# Altium project ДФТВ.434519.003.PrjPcb
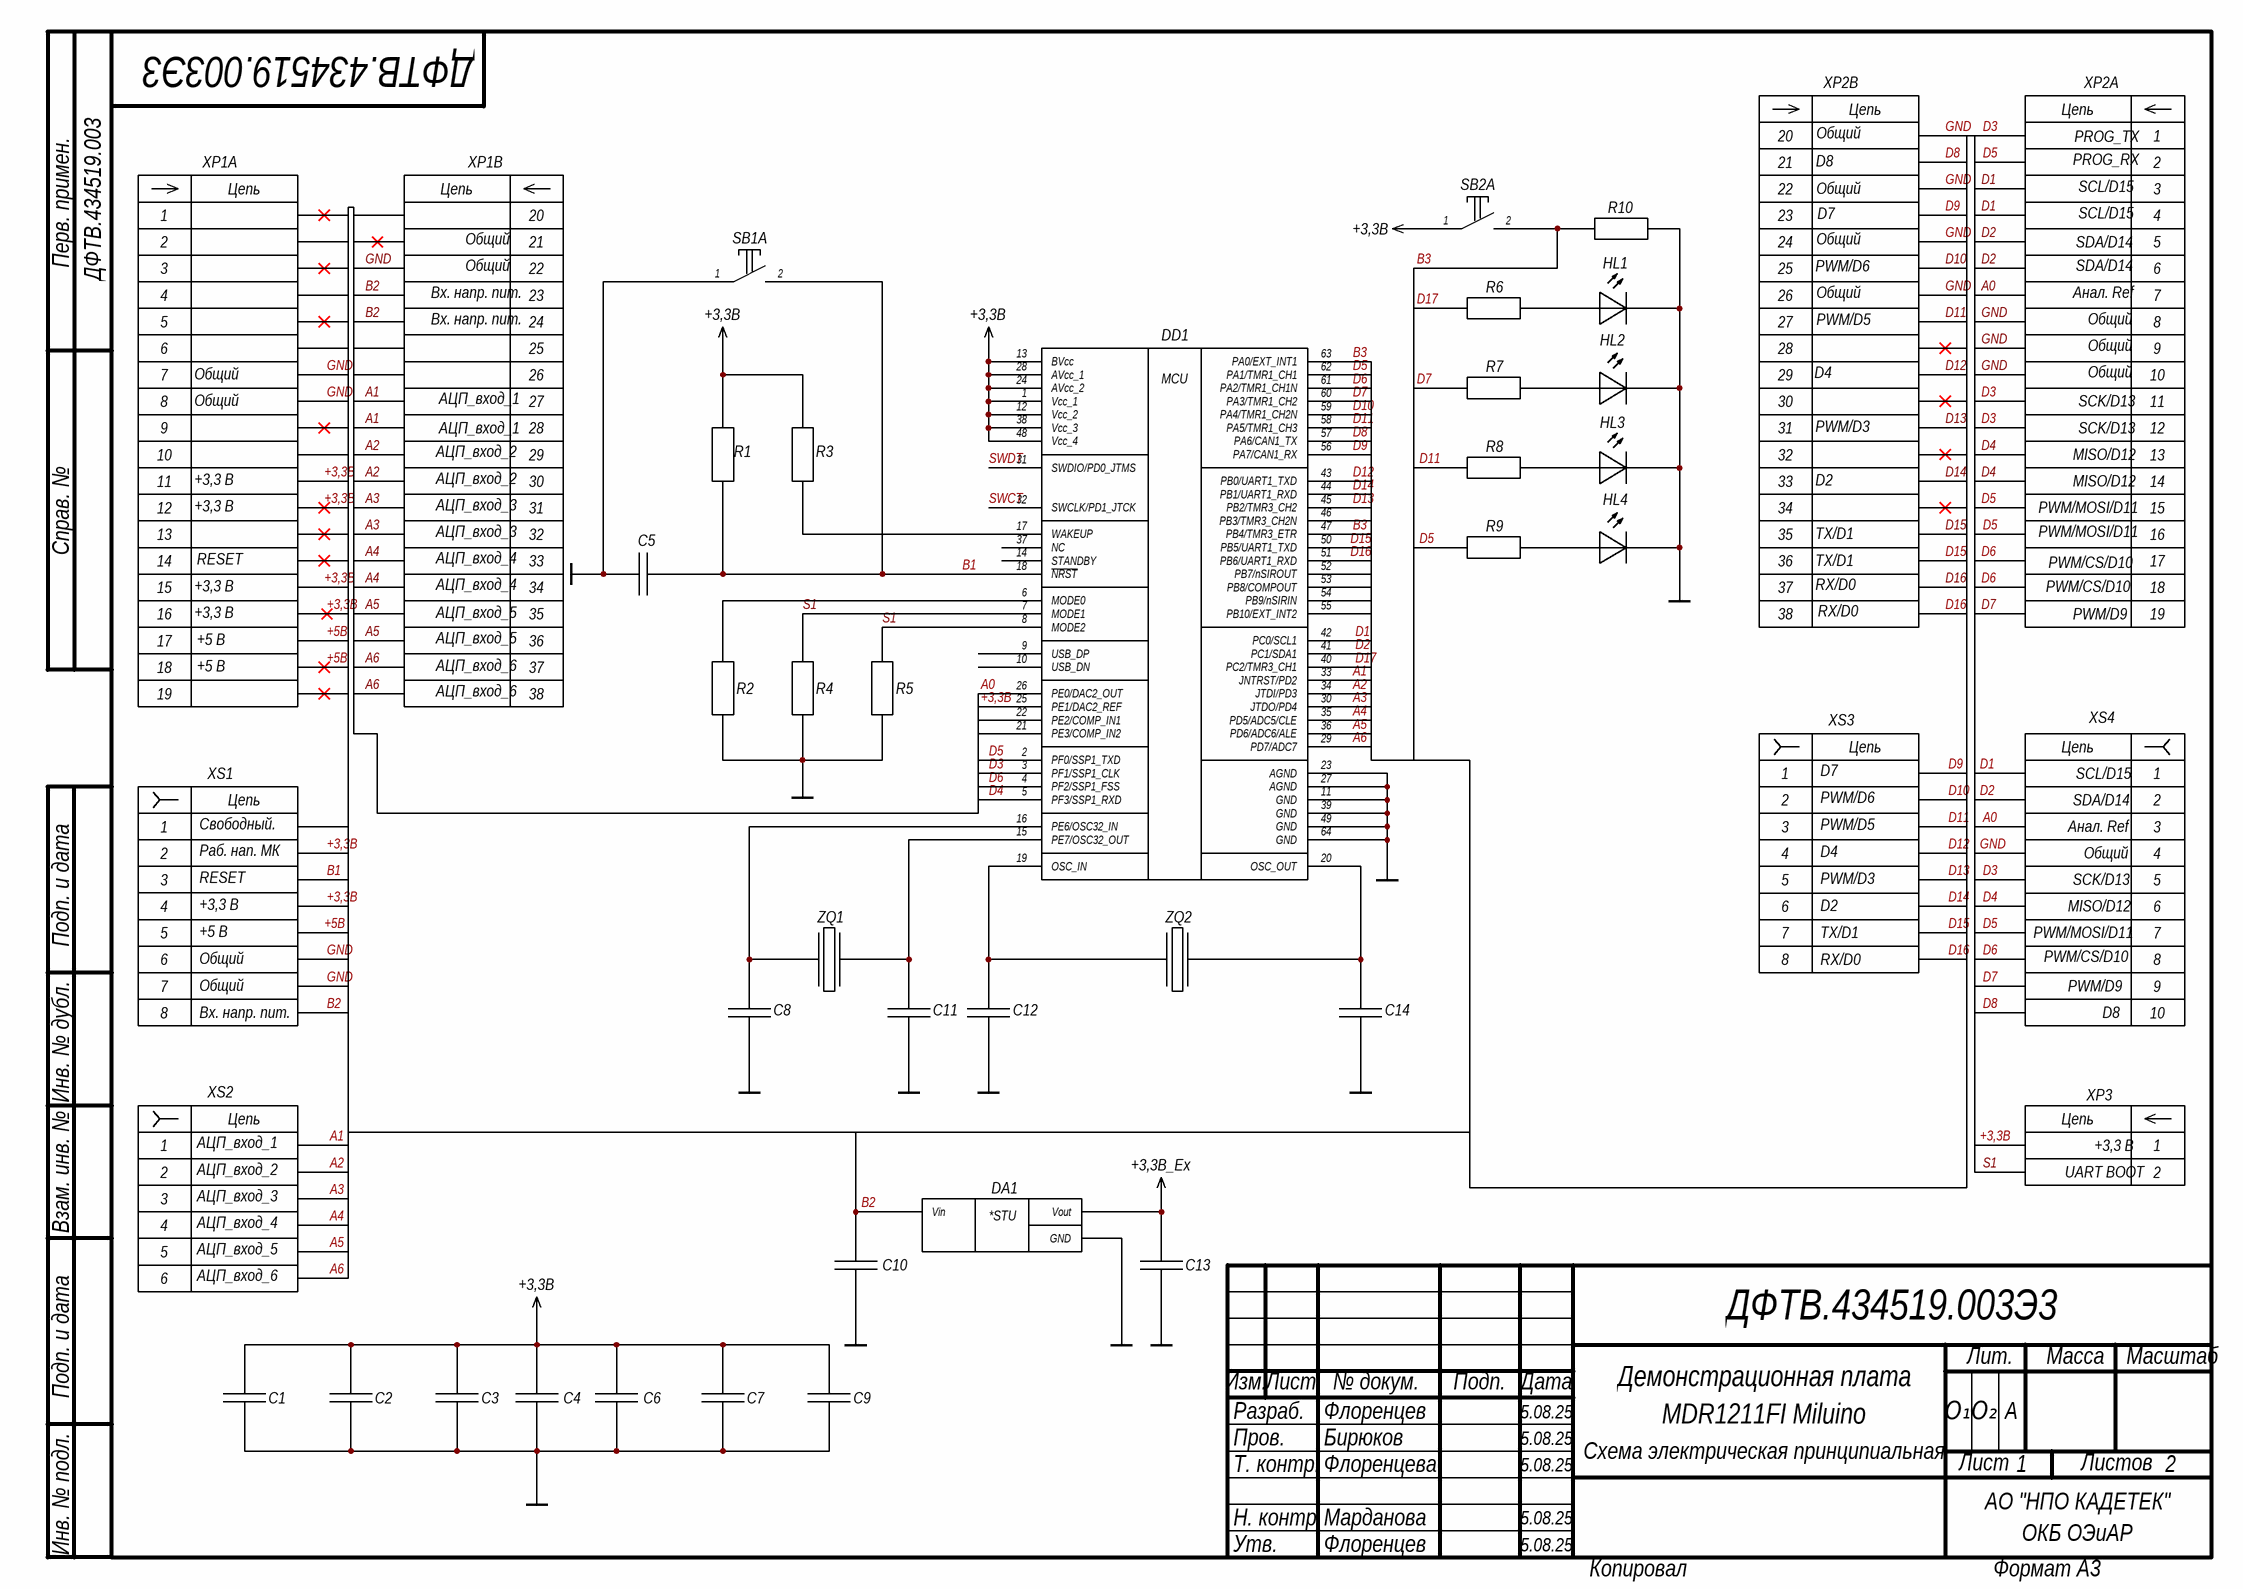
[diagram p0: ДФТВ.434519.003 л.1 Э3.SchDoc]
DecimalNumber: ДФТВ.434519.003; Графа 04 - Литера: О₁; Графа 04 - Литера2: О₂; Графа 04 - Литера3: А; Децимальный номер печатного узла: ДФТВ.434519.003; Код типа схемы: Э3; Компания1: АО "НПО КАДЕТЕК"; Компания2: ОКБ ОЭиАР; Литера1: О₁; Литера2: О₂; Литера3: А; Наименование1: Демонстрационная плата; Наименование2: MDR1211FI Miluino; Нормоконтроль: Марданова; Нормоконтроль_дата: 5.08.25; Обозначение: ДФТВ.434519.003Э3; Папка для сохранения графической документации: Документация; Папка для сохранения текстовой документации: Документация; Проверил: Бирюков; Проверил_дата: 5.08.25; Разработал: Флоренцев; Разработал_дата: 5.08.25; Технолог: Флоренцева; Технолог_дата: 5.08.25; Тип документа: Схема электрическая принципиальная; Утвердил: Флоренцев; Утвердил_дата: 5.08.25
2 sheets, 86 parts. Net scope: global (net labels, ports and power ports of the same name join across sheets).
Board files: ДФТВ.434519.003.101.PcbDoc, ДФТВ.434519.003.200КЭ.PcbDoc
Sheets:
  ДФТВ.434519.003 л.1 Э3.SchDoc
  ДФТВ.434519.003 л.2 Э3.SchDoc

## Sheet ДФТВ.434519.003 л.1 Э3.SchDoc
size 420 x 297 mm; SheetNumber: 1; SheetTotal: 2; ListNumber: 1

### Parts
C1  Конденсатор  [SMD_C0603]  (value not drawn)
C2  Конденсатор  [SMD_C0603]  (value not drawn)
C3  Конденсатор  [SMD_C0603]  (value not drawn)
C4  Конденсатор  [SMD_C0603]  (value not drawn)
C5  Конденсатор  [SMD_C0603]  (value not drawn)
C6  Конденсатор  [SMD_C0603]  (value not drawn)
C7  Конденсатор  [SMD_C0603]  (value not drawn)
C8  Конденсатор  [SMD_C0603]  (value not drawn)
C9  Конденсатор  [SMD_C0603]  (value not drawn)
C10  Конденсатор  [SMD_C0603]  (value not drawn)
C11  Конденсатор  [SMD_C0603]  (value not drawn)
C12  Конденсатор  [SMD_C0603]  (value not drawn)
C13  Конденсатор  [SMD_C0603]  (value not drawn)
C14  Конденсатор  [SMD_C0603]  (value not drawn)
DA1  Преобразователи напряжения  [SOT223]  (value not drawn)
DD1  Микроконтроллеры  [MDR-QFN64_N]  (value not drawn)
HL1  Светодиод  [DIODE: LED-0603-AMBER]  (value not drawn)
HL2  Светодиод  [DIODE: LED-0603-BLUE]  (value not drawn)
HL3  Светодиод  [DIODE: LED-0603-WHITE]  (value not drawn)
HL4  Светодиод  [DIODE: LED-0603-YELLOW]  (value not drawn)
R1  Резистор  [R0603]  (value not drawn)
R2  Резистор  [R0603]  (value not drawn)
R3  Резистор  [R0603]  (value not drawn)
R4  Резистор  [R0603]  (value not drawn)
R5  Резистор  [R0603]  (value not drawn)
R6  Резистор  [R0603]  (value not drawn)
R7  Резистор  [R0603]  (value not drawn)
R8  Резистор  [R0603]  (value not drawn)
R9  Резистор  [R0603]  (value not drawn)
R10  Резистор  [R0603]  (value not drawn)
SB1  Переключатель  [BUT: 6x6 SMD]  (value not drawn)  (part A of 2)
SB2  Переключатель  [BUT: 6x6 SMD]  (value not drawn)  (part A of 2)
XP1  Вилка  [PLDH-38]  (value not drawn)  (parts A,B of 2)
XP2  Вилка  [PLDH-38]  (value not drawn)  (parts A,B of 2)
XP3  Вилка  [PLS-2]  (value not drawn)
XS1  Розетка  [PBS-8]  (value not drawn)
XS2  Розетка  [PBS-6]  (value not drawn)
XS3  Розетка  [PBS-8]  (value not drawn)
XS4  Розетка  [PBS-10]  (value not drawn)
ZQ1  Кварцевые резонаторы  [DSO-N4]  (value not drawn)
ZQ2  Кварцевые резонаторы  [HC-49S]  (value not drawn)

### Nets
+3,3В: C1.2 C2.2 C3.2 C4.2 C6.2 C7.2 C9.2 DD1.1(Vcc_1) DD1.12(Vcc_2) DD1.13(BVcc) DD1.24(AVcc_2) DD1.25(PE1/DAC2_REF) DD1.28(AVcc_1) DD1.38(Vcc_3) DD1.48(Vcc_4) R1.2 R3.2 SB2.1 XP1.11 XP1.12 XP1.15 XP1.16 XP3.1 XS1.2 XS1.4
+3,3В_Ex: C13.2 DA1.2(Vout)
+5В: XP1.17 XP1.18 XS1.5
GND: C1.1 C2.1 C3.1 C4.1 C5.2 C6.1 C7.1 C8.1 C9.1 C10.1 C11.1 C12.1 C13.1 C14.1 DA1.1(GND) DD1.11(GND) DD1.23(AGND) DD1.27(AGND) DD1.39(GND) DD1.49(GND) DD1.64(GND) HL1.K HL2.K HL3.K HL4.K R2.1 R4.1 R5.1 R10.1 SB1.1 XP1.7 XP1.8 XP1.22 XP2.8 XP2.9 XP2.10 XP2.20 XP2.22 XP2.24 XP2.26 XS1.6 XS1.7 XS4.4
A0: DD1.26(PE0/DAC2_OUT) XP2.7 XS4.3
A1: DD1.33(JNTRST/PD2) XP1.27 XP1.28 XS2.1
A2: DD1.34(JTDI/PD3) XP1.29 XP1.30 XS2.2
A3: DD1.30(JTDO/PD4) XP1.31 XP1.32 XS2.3
A4: DD1.35(PD5/ADC5/CLE) XP1.33 XP1.34 XS2.4
A5: DD1.36(PD6/ADC6/ALE) XP1.35 XP1.36 XS2.5
A6: DD1.29(PD7/ADC7) XP1.37 XP1.38 XS2.6
B1: C5.1 DD1.18(~{NRST}) R1.1 SB1.2 XS1.3
B2: C10.2 DA1.3(Vin) XP1.23 XP1.24 XS1.8
B3: DD1.47(PB4/TMR3_ETR) DD1.63(PA0/EXT_INT1) R10.2 SB2.2
D1: DD1.42(PC0/SCL1) XP2.3 XP2.4 XS4.1
D2: DD1.41(PC1/SDA1) XP2.5 XP2.6 XS4.2
D3: DD1.3(PF1/SSP1_CLK) XP2.1 XP2.11 XP2.12 XS4.5
D4: DD1.5(PF3/SSP1_RXD) XP2.13 XP2.14 XS4.6
D5: DD1.2(PF0/SSP1_TXD) DD1.62(PA1/TMR1_CH1) R9.2 XP2.2 XP2.15 XP2.16 XS4.7
D6: DD1.4(PF2/SSP1_FSS) DD1.61(PA2/TMR1_CH1N) XP2.17 XP2.18 XS4.8
D7: DD1.60(PA3/TMR1_CH2) R7.2 XP2.19 XS4.9
D8: DD1.57(PA6/CAN1_TX) XP2.21 XS4.10
D9: DD1.56(PA7/CAN1_RX) XP2.23 XS3.1
D10: DD1.59(PA4/TMR1_CH2N) XP2.25 XS3.2
D11: DD1.58(PA5/TMR1_CH3) R8.2 XP2.27 XS3.3
D12: DD1.43(PB0/UART1_TXD) XP2.29 XS3.4
D13: DD1.45(PB2/TMR3_CH2) XP2.31 XS3.5
D14: DD1.44(PB1/UART1_RXD) XP2.33 XS3.6
D15: DD1.50(PB5/UART1_TXD) XP2.35 XP2.36 XS3.7
D16: DD1.51(PB6/UART1_RXD) XP2.37 XP2.38 XS3.8
D17: DD1.40(PC2/TMR3_CH1) R6.2
S1: DD1.7(MODE1) DD1.8(MODE2) R4.2 R5.2 XP3.2
SWCT: DD1.32(SWCLK/PD1_JTCK)
SWDT: DD1.31(SWDIO/PD0_JTMS)
NetC8_2: C8.2 DD1.16(PE6/OSC32_IN) ZQ1.1
NetC11_2: C11.2 DD1.15(PE7/OSC32_OUT) ZQ1.3
NetC12_2: C12.2 DD1.19(OSC_IN) ZQ2.1
NetC14_2: C14.2 DD1.20(OSC_OUT) ZQ2.3
NetDD1_6: DD1.6(MODE0) R2.2
NetDD1_17: DD1.17(WAKEUP) R3.1
NetHL1_A: HL1.A R6.1
NetHL2_A: HL2.A R7.1
NetHL3_A: HL3.A R8.1
NetHL4_A: HL4.A R9.1

Not connected (* = marked no-connect by the designer): DD1 9(USB_DP) 10(USB_DN) 14(STANDBY) 21(PE3/COMP_IN2) 22(PE2/COMP_IN1) 37(NC) 46(PB3/TMR3_CH2N) 52(PB7/nSIROUT) 53(PB8/COMPOUT) 54(PB9/nSIRIN) 55(PB10/EXT_INT2); XP1 1* 2 3* 4 5* 6 9* 10 13* 14* 19* 20 21* 25 26; XP2 28* 30* 32* 34*; XS1 1

### Notes on the sheet
- D8
- Общий
- (near XP2) PROG_RX
- (near XP2) PROG_TX
- (near XP2) SCL/D15
- D7
- (near XP2) SDA/D14
- (near XP1) Вх. напр. пит.
- (near XP2) PWM/D6
- (near XP2) PWM/D5
- (near XP2) Анал. Ref
- D4
- (near XP1) АЦП_вход_2
- (near XP1) АЦП_вход_1
- (near XP2) PWM/D3
- (near XP2) MISO/D12
- (near XP2) SCK/D13
- (near XP1) +3,3 В
- (near XP1) АЦП_вход_3
- D2
- (near XP2) PWM/MOSI/D11
- RESET
- (near XP1) АЦП_вход_4
- TX/D1
- RX/D0
- (near XP2) PWM/CS/D10
- +5 В
- (near XP1) АЦП_вход_5
- (near XP2) PWM/D9
- (near XP1) АЦП_вход_6
- (near XS4) SCL/D15
- (near XS1) Свободный.
- (near XS1) Раб. нап. МК
- (near XS3) PWM/D5
- (near XS3) PWM/D6
- (near XS4) Анал. Ref
- (near XS4) SDA/D14
- (near XS1) +3,3 В
- (near XS3) PWM/D3
- (near XS4) MISO/D12
- (near XS4) SCK/D13
- (near XS4) PWM/MOSI/D11
- (near XS4) PWM/CS/D10
- (near XS4) PWM/D9
- (near XS1) Вх. напр. пит.
- (near XS2) АЦП_вход_1
- (near XS2) АЦП_вход_2
- (near XS2) АЦП_вход_3
- (near XP3) UART BOOT
- +3,3 В
- (near XS2) АЦП_вход_4
- (near XS2) АЦП_вход_5
- (near XS2) АЦП_вход_6
- Перв. примен.
- Справ. №
- Подп. и дата
- Инв. № дубл.
- Взам. инв. №
- Разраб.
- Изм.
- Лист
- № докум.
- Подп.
- Дата
- Лит.
- Масса
- Масштаб
- Пров.
- Т. контр.
- Листов
- Инв. № подл.
- Н. контр.
- Утв.
- Копировал
- Формат А3
- (in symbol AMS1117-3.3) *STU
- (in symbol Вилка 2 контакт) Цепь
- (in symbol Вилка 38 контактов, part A) Цепь
- (in symbol Вилка 38 контактов, part B) Цепь
- (in symbol Микроконтроллер К1986ВЕ92QI) MCU
- (in symbol Розетка 6 контактов) Цепь
- (in symbol Розетка 8 контактов) Цепь
- (in symbol Розетка 10 контактов) Цепь

### Library data of the parts
C1-C7 C9 C10 C13 = Конденсаторы керамические: АДПК.673511.021 ТУ; Model: CL21B104JBCNNNC; Product Code: 34 1469; Component Name: К10-79-10В-0,1 мкФ+80/-20%-Н90; Value: 0.1 мкФ; Published: 18.05.2019; Publisher: АО НПО "КАДЕТЕК"; Distributer: АО НИИ "Гириконд"; TU/GOST: АДПК.673511.021 ТУ; Category: Конденсатор
C8 C11 C12 C14 = Конденсаторы керамические: АДПК.673511.021 ТУ; Model: CL21B104JBCNNNC; Product Code: 34 1469; Component Name: К10-79-100В-24 пФ±5%-МП0; Value: 24 пФ; Published: 18.05.2019; Publisher: АО НПО "КАДЕТЕК"; Distributer: АО НИИ "Гириконд"; TU/GOST: АДПК.673511.021 ТУ; Category: Конденсатор
DA1 = AMS1117-3.3: фирма Advanced Monolithic System; TU/GOST: ДВУК.431433.326-001ТУ; Product Code: 63 3300; Component Name: GM1117S-3.3ST3RG; Distributer: АО «Микрон»; Category: Преобразователи напряжения; Model: AMS1117-3.3
DD1 = Микроконтроллер К1986ВЕ92QI: ТСКЯ.431000.001 ТУ; Model: К1986ВЕ92FI; Product Code: 63 3900; Distributer: АО "ПКК Миландр"; Category: Микроконтроллеры; TU/GOST: ТСКЯ.431000.001 ТУ; Component Name: К1986ВЕ92FI
HL1 = Светодиоды: фирма Kingbright Elec. Co., Ltd; TU/GOST: АЕЯР.432220.765 ТУ; Value: 2.1 V; Model: BL-L2506URC; Product Code: 63 1000; Component Name: ИПД169А91-Ж; Published: 24-Mar-1999; LatestRevisionDate: 17-Jul-2002; LatestRevisionNote: Re-released for DXP Platform.; PackageReference: PIN2; Publisher: Altium Limited; Distributer: АО "ПРОТОН"; Category: Светодиод
HL2 = Светодиоды: фирма Kingbright Elec. Co., Ltd; TU/GOST: АЕЯР.432220.765 ТУ; Value: 2.1 V; Model: BL-L2506URC; Product Code: 63 1000; Component Name: ИПД169А91-С; Published: 24-Mar-1999; LatestRevisionDate: 17-Jul-2002; LatestRevisionNote: Re-released for DXP Platform.; PackageReference: PIN2; Publisher: Altium Limited; Distributer: АО "ПРОТОН"; Category: Светодиод
HL3 = Светодиоды: фирма Ningbo Foryard; TU/GOST: АЕЯР.432220.765 ТУ; Value: 2.1 V; Model: BL-L2506URC; Product Code: 63 1000; Component Name: ИПД169А91-Б; Published: 24-Mar-1999; LatestRevisionDate: 17-Jul-2002; LatestRevisionNote: Re-released for DXP Platform.; PackageReference: PIN2; Publisher: Altium Limited; Distributer: АО "ПРОТОН"; Category: Светодиод
HL4 = Светодиоды: фирма Kingbright Elec. Co., Ltd; TU/GOST: АЕЯР.432220.765 ТУ; Value: 2.1 V; Model: BL-L2506URC; Product Code: 63 1000; Component Name: ИПД169А91-K; Published: 24-Mar-1999; LatestRevisionDate: 17-Jul-2002; LatestRevisionNote: Re-released for DXP Platform.; PackageReference: PIN2; Publisher: Altium Limited; Distributer: АО "ПРОТОН"; Category: Светодиод
R1-R5 R10 = Резисторы без указания рассеиваемой мощности: АЛЯР. 434110.005 ТУ; TU/GOST: АБШК.434110.023 ТУ; Product Code: 61 9900; Component Name: Р1-12-0,1-10 кОм±5%-М-"К"; Value: 10 кОм; Published: 8-Jun-2000; LatestRevisionDate: 17-Jul-2002; LatestRevisionNote: Re-released for DXP Platform.; PackageReference: AXIAL-0.4; Publisher: SPA CADETECH JSC; PackageDescription: Axial Device, Thru-Hole; 2 Leads; 0.4 in Pin Spacing; Model: R0603; Category: Резистор; Distributer: АО "НПО ЭРКОН"
R6-R9 = Резисторы без указания рассеиваемой мощности: АЛЯР. 434110.005 ТУ; TU/GOST: АБШК.434110.023 ТУ; Product Code: 61 9900; Component Name: Р1-12-0,1-330 Ом±5%-М-"К"; Value: 330 Ом; Published: 8-Jun-2000; LatestRevisionDate: 17-Jul-2002; LatestRevisionNote: Re-released for DXP Platform.; PackageReference: AXIAL-0.4; Publisher: SPA CADETECH JSC; PackageDescription: Axial Device, Thru-Hole; 2 Leads; 0.4 in Pin Spacing; Model: R0603; Category: Резистор; Distributer: АО "НПО ЭРКОН"
SB1 SB2 = BT-02x-01p_S: фирма KLS electronic co ltd; Product Code: 34 6422; Component Name: KLS7-TS6604-7.0-180-B(Т); Published: 17.04.2014; Publisher: Andrew Danich; Type: Переключатель; TU/GOST: фирма KLS electronic co ltd; Distributer: АО "Чип и Дип"
XP1 XP2 = Вилка 38 контактов: РЮМК.430420.019 ТУ; TU/GOST: РЮМК.430420.041 ТУ; Product Code: 66 7250; Component Name: СНП377-38ВП21-2-14-6,0; Distributer: АО "КАРАЧЕВСКИЙ ЗАВОД "ЭЛЕКТРОДЕТАЛЬ"; Category: Вилка
XP3 = Вилка 2 контакт: Connfly electronic (Zhenqin); TU/GOST: РЮМК.430420.051 ТУ; Product Code: 34 6430; Component Name: СНП393-2ВП21-1-01-6,5; Distributer: АО "КАРАЧЕВСКИЙ ЗАВОД "ЭЛЕКТРОДЕТАЛЬ"; Category: Вилка
XS1 XS3 = Розетка 8 контактов: РЮМК.430420.019 ТУ; TU/GOST: РЮМК.430420.051 ТУ; Product Code: 66 7250; Model: PBD-8; Component Name: СНП393-8РП21-1; Type: Розетка; Distributer: АО "КАРАЧЕВСКИЙ ЗАВОД "ЭЛЕКТРОДЕТАЛЬ"; Category: Розетка
XS2 = Розетка 6 контактов: РЮМК.430420.019 ТУ; Product Code: 66 7250; Component Name: СНП393-6РП21-1; Type: Розетка; TU/GOST: РЮМК.430420.019 ТУ; Distributer: АО "КАРАЧЕВСКИЙ ЗАВОД "ЭЛЕКТРОДЕТАЛЬ"; Category: Розетка; Model: PBS-6
XS4 = Розетка 10 контактов: РЮМК.430420.019 ТУ; TU/GOST: РЮМК.430420.051 ТУ; Product Code: 66 7250; Component Name: СНП393-10РП21-1; Type: Розетка; Distributer: АО "КАРАЧЕВСКИЙ ЗАВОД "ЭЛЕКТРОДЕТАЛЬ"; Category: Розетка; Model: PBS-10
ZQ1 = Кварцевые резонаторы: КЖДГ.433513.017 ТУ; Alternating Manufacture: АО "Завод "Метеор"; Product Code: 63 2100; Model: SMD07050C4; TU/GOST: фирма EPSON; Value: 32768 Hz; Component Name: MC-206 32,768 кГц; Published: 24.05.2021; Publisher: АО "НПО КАДЕТЕК"; Distributer: АО "Чип и Дип"; Category: Кварцевые резонаторы; Type: SMD07050C4
ZQ2 = Кварцевые резонаторы: КЖДГ.433513.026ТУ; Alternating Manufacture: Chequers Electronic Limited; Product Code: 63 2100; Model: HC49S; Value: 12 MHz; Component Name: РК597-МД3-5АС-16000К-П24; Published: 24.05.2021; Publisher: АО "НПО КАДЕТЕК"; Distributer: АО «Завод «Метеор»; TU/GOST: КЖДГ.433513.026ТУ; Category: Кварцевые резонаторы; Type: SMD07050C4

## Sheet ДФТВ.434519.003 л.2 Э3.SchDoc
size 420 x 297 mm; SheetNumber: 2; ListNumber: 1
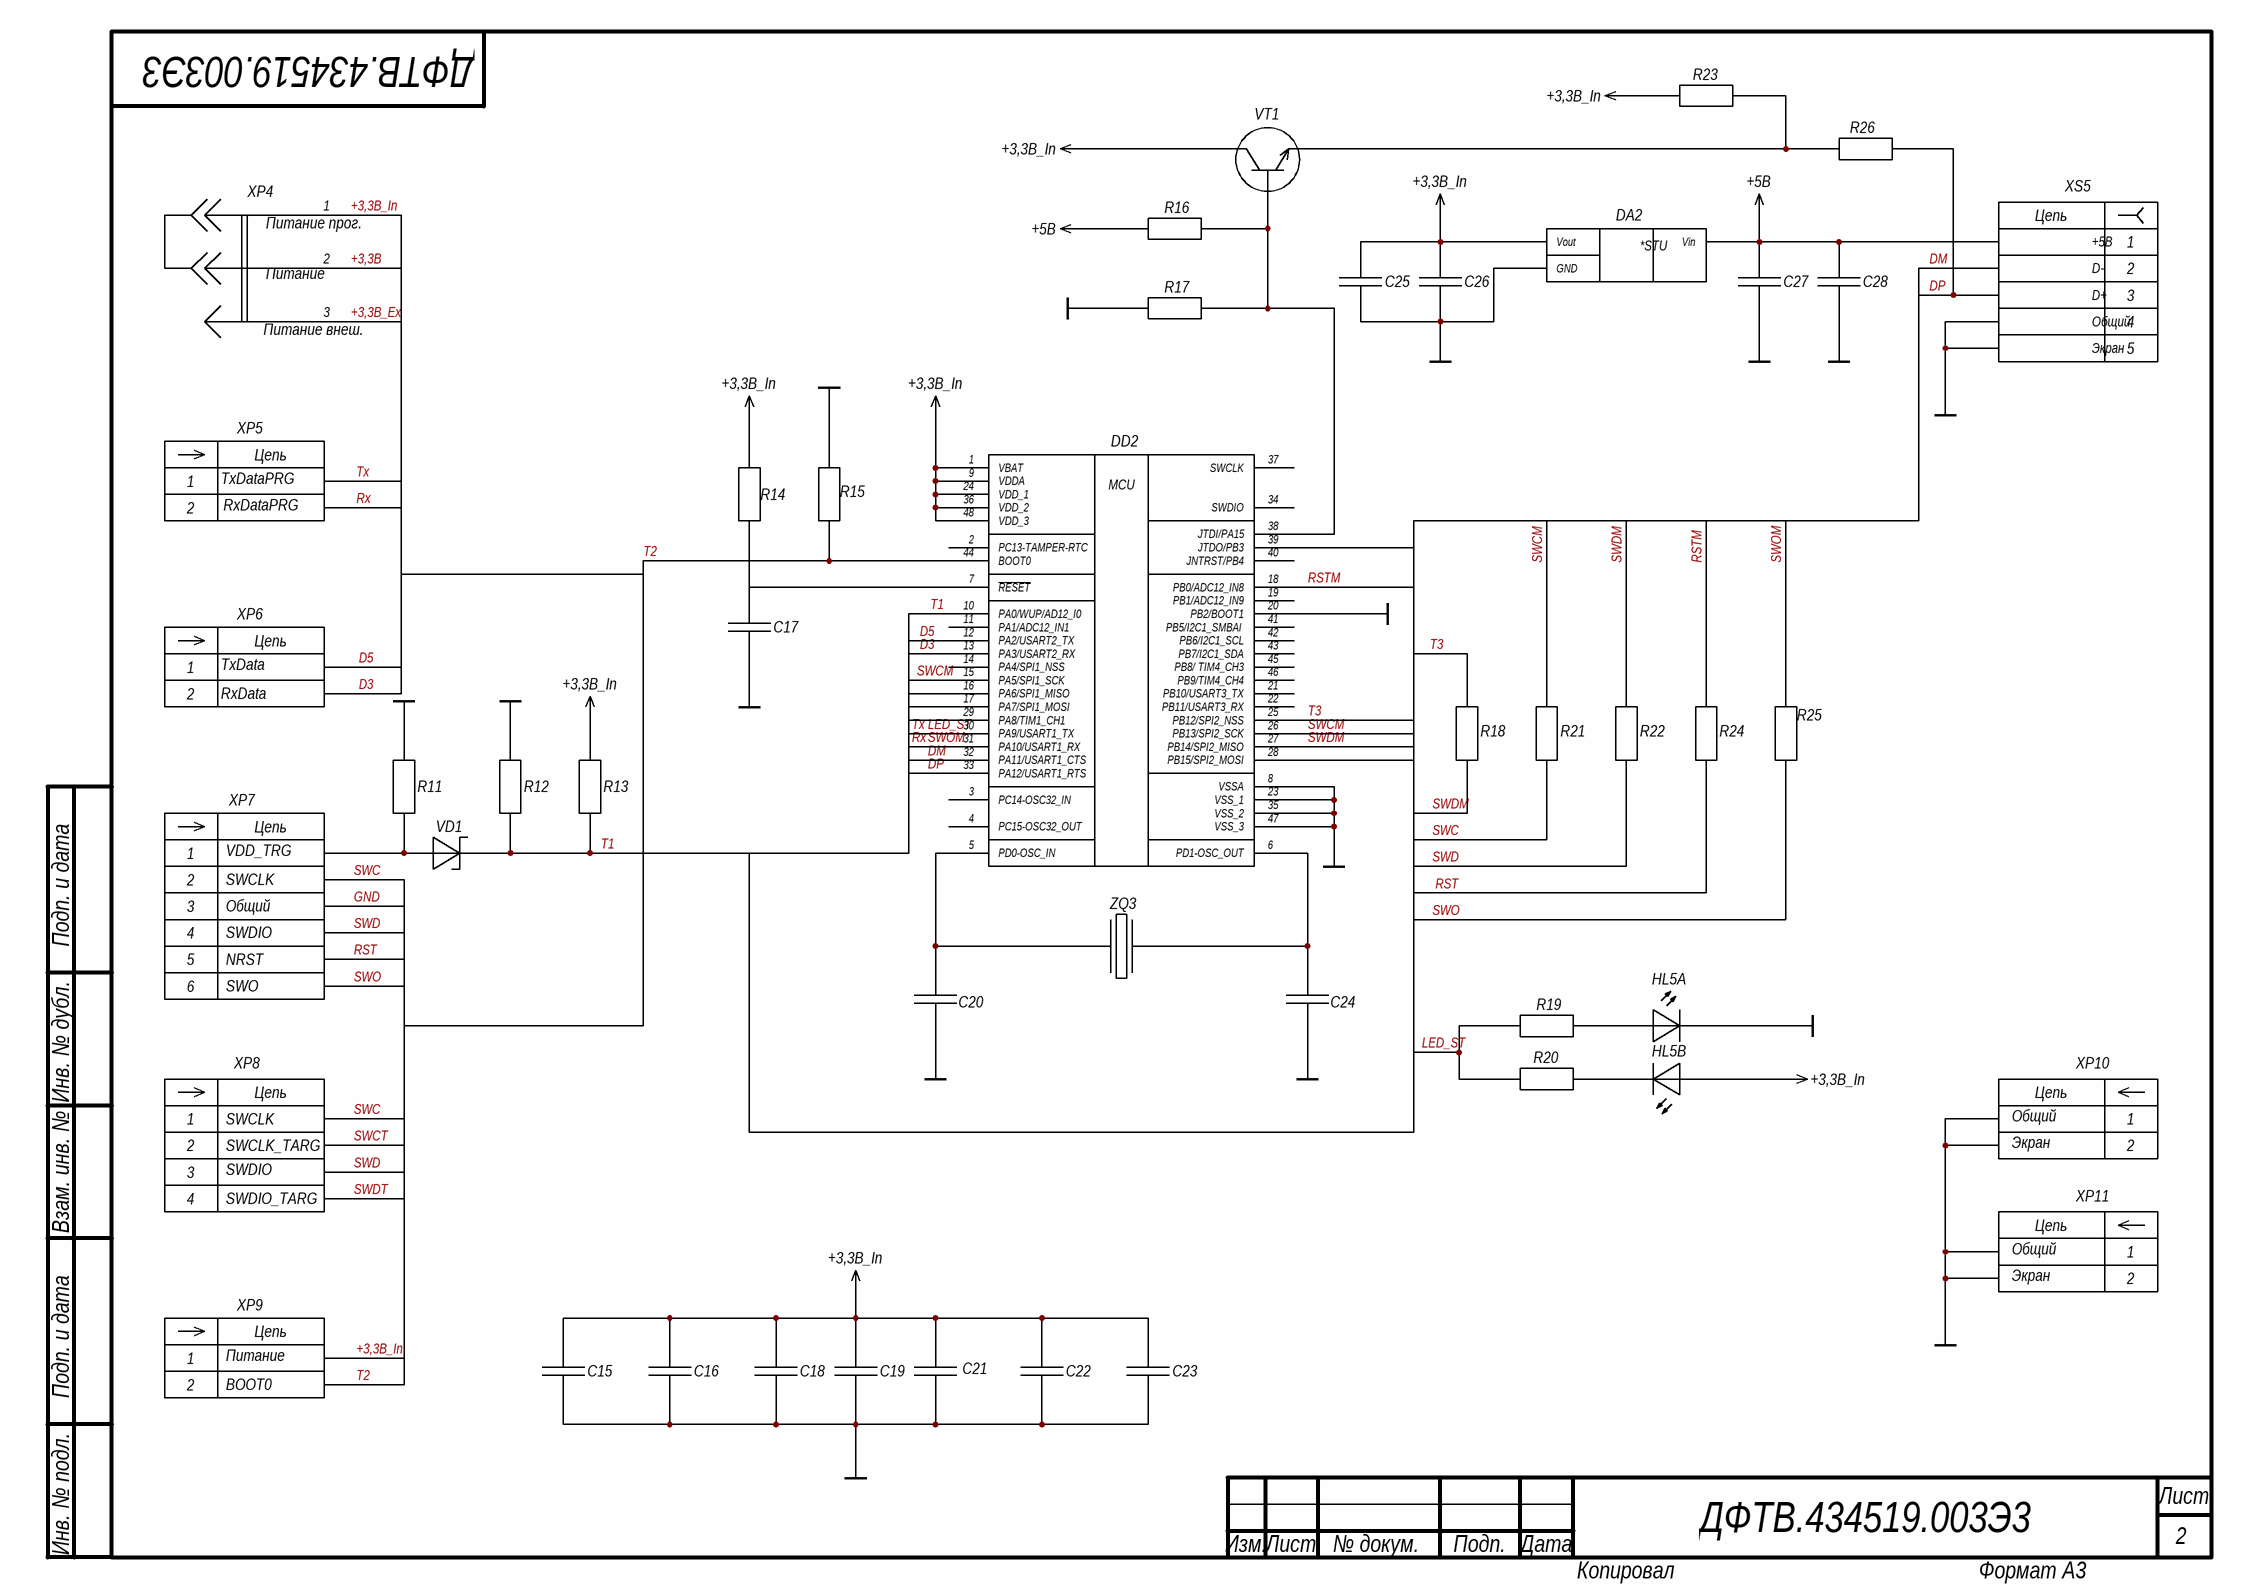
[diagram p1: ДФТВ.434519.003 л.2 Э3.SchDoc]

### Parts
C15  Конденсатор  [SMD_C0603]  (value not drawn)
C16  Конденсатор  [SMD_C0603]  (value not drawn)
C17  Конденсатор  [SMD_C0603]  (value not drawn)
C18  Конденсатор  [SMD_C0603]  (value not drawn)
C19  Конденсатор  [SMD_C0603]  (value not drawn)
C20  Конденсатор  [SMD_C0603]  (value not drawn)
C21  Конденсатор  [SMD_C0603]  (value not drawn)
C22  Конденсатор  [SMD_C0603]  (value not drawn)
C23  Конденсатор  [SMD_C0603]  (value not drawn)
C24  Конденсатор  [SMD_C0603]  (value not drawn)
C25  Конденсатор  [SMD_C0603]  (value not drawn)
C26  Конденсатор  [SMD_C0603]  (value not drawn)
C27  Конденсатор  [SMD_C0603]  (value not drawn)
C28  Конденсатор  [SMD_C0603]  (value not drawn)
DA2  Преобразователи напряжения  [SOT223]  (value not drawn)
DD2  Микроконтроллеры  [UFQFPN48]  (value not drawn)
HL5  Светодиод  [DIODE: LED 3528]  (value not drawn)  (parts A,B of 2)
R11  Резистор  [R0603]  (value not drawn)
R12  Резистор  [R0603]  (value not drawn)
R13  Резистор  [R0603]  (value not drawn)
R14  Резистор  [R0603]  (value not drawn)
R15  Резистор  [R0603]  (value not drawn)
R16  Резистор  [R0603]  (value not drawn)
R17  Резистор  [R0603]  (value not drawn)
R18  Резистор  [R0603]  (value not drawn)
R19  Резистор  [R0603]  (value not drawn)
R20  Резистор  [R0603]  (value not drawn)
R21  Резистор  [R0603]  (value not drawn)
R22  Резистор  [R0603]  (value not drawn)
R23  Резистор  [R0603]  (value not drawn)
R24  Резистор  [R0603]  (value not drawn)
R25  Резистор  [R0603]  (value not drawn)
R26  Резистор  [R0603]  (value not drawn)
VD1  Диод Шоттки  [DIODE: SOD323F]  (value not drawn)
VT1  Транзистор  [SOT23-3H]  (value not drawn)
XP4  Вилка  [PLS-3-J]  (value not drawn)
XP5  Вилка  [PLS-2]  (value not drawn)
XP6  Вилка  [PLS-2]  (value not drawn)
XP7  Вилка  [PLS-6]  (value not drawn)
XP8  Вилка  [PLS-4]  (value not drawn)
XP9  Вилка  [PLS-2]  (value not drawn)
XP10  Вилка  [PLS-2]  (value not drawn)
XP11  Вилка  [PLS-2]  (value not drawn)
XS5  Розетка  [USB_MINI_Type_b]  (value not drawn)
ZQ3  Кварцевые резонаторы  [HC-49S]  (value not drawn)

### Nets
+3,3В: XP4.2
+3,3В_Ex: XP4.3
+3,3В_In: C15.2 C16.2 C18.2 C19.2 C21.2 C22.2 C23.2 C25.2 C26.2 DA2.2(Vout) DD2.1(VBAT) DD2.9(VDDA) DD2.24(VDD_1) DD2.36(VDD_2) DD2.48(VDD_3) HL5.4 R13.2 R14.2 R23.2 VT1.3(К) XP4.1 XP9.1
+5В: C27.2 C28.2 DA2.3(Vin) R16.2 XS5.1
GND: C15.1 C16.1 C17.1 C18.1 C19.1 C20.1 C21.1 C22.1 C23.1 C24.1 C25.1 C26.1 C27.1 C28.1 DA2.1(GND) DD2.8(VSSA) DD2.20(PB2/BOOT1) DD2.23(VSS_1) DD2.35(VSS_2) DD2.47(VSS_3) HL5.1 R11.2 R12.2 R15.2 R17.2 XP7.3 XP10.1 XP10.2 XP11.1 XP11.2 XS5.4 XS5.5
D3: DD2.13(PA3/USART2_RX) XP6.2
D5: DD2.12(PA2/USART2_TX) XP6.1
DM: DD2.32(PA11/USART1_CTS) XS5.2
DP: DD2.33(PA12/USART1_RTS) R26.1 XS5.3
LED_ST: DD2.30(PA9/USART1_TX) R19.1 R20.1 XP5.1  [also labelled Tx]
RST: R24.2 XP7.5
RSTM: DD2.18(PB0/ADC12_IN8) R24.1
Rx: DD2.31(PA10/USART1_RX) R25.1 XP5.2  [also labelled SWOM]
SWC: R21.2 XP7.2 XP8.1
SWCM: DD2.15(PA5/SPI1_SCK) DD2.26(PB13/SPI2_SCK) R21.1
SWCT: XP8.2
SWD: R22.2 XP7.4 XP8.3
SWDM: DD2.27(PB14/SPI2_MISO) R18.2 R22.1
SWDT: XP8.4
SWO: R25.2 XP7.6
T1: DD2.10(PA0/WUP/AD12_I0) R12.1 R13.1 VD1.K
T2: DD2.44(BOOT0) R15.1 XP9.2
T3: DD2.25(PB12/SPI2_NSS) R18.1
NetC17_2: C17.2 DD2.7(~{RESET}) R14.1
NetC20_2: C20.2 DD2.5(PD0-OSC_IN) ZQ3.1
NetC24_2: C24.2 DD2.6(PD1-OSC_OUT) ZQ3.3
NetDD2_38: DD2.38(JTDI/PA15) R16.1 R17.1 VT1.1(Б)
NetHL5_2: HL5.2 R19.2
NetHL5_3: HL5.3 R20.2
NetR11_1: R11.1 VD1.A XP7.1
NetR23_1: R23.1 R26.2 VT1.2(Э)

Not connected (* = marked no-connect by the designer): DD2 2(PC13-TAMPER-RTC) 3(PC14-OSC32_IN) 4(PC15-OSC32_OUT) 11(PA1/ADC12_IN1) 14(PA4/SPI1_NSS) 16(PA6/SPI1_MISO) 17(PA7/SPI1_MOSI) 19(PB1/ADC12_IN9) 21(PB10/USART3_TX) 22(PB11/USART3_RX) 28(PB15/SPI2_MOSI) 29(PA8/TIM1_CH1) 34(SWDIO) 37(SWCLK) 39(JTDO/PB3) 40(JNTRST/PB4) 41(PB5/I2C1_SMBAl_) 42(PB6/I2C1_SCL) 43(PB7/I2C1_SDA) 45(PB8/_TIM4_CH3) 46(PB9/TIM4_CH4)

### Notes on the sheet
- (near XP4) Питание прог.
- (near XP4) Питание
- (near XP4) Питание внеш.
- (near XP5) TxDataPRG
- (near XP5) RxDataPRG
- (near XP6) TxData
- (near XP6) RxData
- (near XP7) VDD_TRG
- SWCLK
- Общий
- SWDIO
- NRST
- SWO
- (near XP10) Общий
- (near XP8) SWCLK_TARG
- (near XP8) SWDIO_TARG
- (near XP10) Экран
- (near XP11) Общий
- (near XP11) Экран
- (near XP9) Питание
- BOOT0
- Подп. и дата
- Инв. № дубл.
- Взам. инв. №
- Инв. № подл.
- Изм.
- Лист
- № докум.
- Подп.
- Дата
- Копировал
- Формат А3
- (in symbol AMS1117-3.3) *STU
- (in symbol Вилка 2 контакт) Цепь
- (in symbol Вилка 4 контакта) Цепь
- (in symbol Вилка 6 контактов) Цепь
- (in symbol Микроконтроллер STM32F103) MCU
- (in symbol Розетка USB mini) Цепь; +5В; D-; D+; Общий; Экран

### Library data of the parts
C15-C19 C21-C23 C25-C28 = Конденсаторы керамические: as C1 on sheet ДФТВ.434519.003 л.1 Э3; Published: 18.05.2019; Publisher: АО НПО "КАДЕТЕК"; Distributer: АО НИИ "Гириконд"; TU/GOST: АДПК.673511.021 ТУ; Category: Конденсатор
C20 C24 = Конденсаторы керамические: as C8 on sheet ДФТВ.434519.003 л.1 Э3; Published: 18.05.2019; Publisher: АО НПО "КАДЕТЕК"; Distributer: АО НИИ "Гириконд"; TU/GOST: АДПК.673511.021 ТУ; Category: Конденсатор
DA2 = AMS1117-3.3: as DA1 on sheet ДФТВ.434519.003 л.1 Э3; Distributer: АО «Микрон»; Category: Преобразователи напряжения; Model: AMS1117-3.3
DD2 = Микроконтроллер STM32F103: фирма STMicroelectronics(ST); Model: STM32F103CBU6; Product Code: 63 3900; Distributer: АО "Чип и Дип"; Category: Микроконтроллеры; TU/GOST: фирма STMicroelectronics(ST); Component Name: STM32F103CBU6
HL5 = Светодиоды_сдвоенные: фирма Kingbright; Value: 2.1 V; Model: KAA-3528ESGC; Product Code: 63 1000; Published: 24-Mar-1999; LatestRevisionDate: 17-Jul-2002; LatestRevisionNote: Re-released for DXP Platform.; PackageReference: PIN2; Publisher: Altium Limited; Distributer: АО "Чип и Дип"; Category: Светодиод; TU/GOST: фирма Kingbright; Component Name: KAA-3528ESGC
R11 R14-R17 = Резисторы без указания рассеиваемой мощности: as R1 on sheet ДФТВ.434519.003 л.1 Э3; Published: 8-Jun-2000; LatestRevisionDate: 17-Jul-2002; LatestRevisionNote: Re-released for DXP Platform.; PackageReference: AXIAL-0.4; Publisher: SPA CADETECH JSC; PackageDescription: Axial Device, Thru-Hole; 2 Leads; 0.4 in Pin Spacing; Model: R0603; Category: Резистор; Distributer: АО "НПО ЭРКОН"
R12 R13 = Резисторы без указания рассеиваемой мощности: АЛЯР. 434110.005 ТУ; TU/GOST: АБШК.434110.023 ТУ; Product Code: 61 9900; Component Name: Р1-12-0,1-4.7 кОм±5%-М-"К"; Value: 4.7 кОм; Published: 8-Jun-2000; LatestRevisionDate: 17-Jul-2002; LatestRevisionNote: Re-released for DXP Platform.; PackageReference: AXIAL-0.4; Publisher: SPA CADETECH JSC; PackageDescription: Axial Device, Thru-Hole; 2 Leads; 0.4 in Pin Spacing; Model: R0603; Category: Резистор; Distributer: АО "НПО ЭРКОН"
R18 = Резисторы без указания рассеиваемой мощности: АЛЯР. 434110.005 ТУ; TU/GOST: АБШК.434110.023 ТУ; Product Code: 61 9900; Component Name: Р1-12-0,1-220 Ом±5%-М-"К"; Value: 220 Ом; Published: 8-Jun-2000; LatestRevisionDate: 17-Jul-2002; LatestRevisionNote: Re-released for DXP Platform.; PackageReference: AXIAL-0.4; Publisher: SPA CADETECH JSC; PackageDescription: Axial Device, Thru-Hole; 2 Leads; 0.4 in Pin Spacing; Model: R0603; Category: Резистор; Distributer: АО "НПО ЭРКОН"
R19 R20 = Резисторы без указания рассеиваемой мощности: АЛЯР. 434110.005 ТУ; TU/GOST: АБШК.434110.023 ТУ; Product Code: 61 9900; Component Name: Р1-12-0,1-100 Ом±5%-М-"К"; Value: 100; Published: 8-Jun-2000; LatestRevisionDate: 17-Jul-2002; LatestRevisionNote: Re-released for DXP Platform.; PackageReference: AXIAL-0.4; Publisher: SPA CADETECH JSC; PackageDescription: Axial Device, Thru-Hole; 2 Leads; 0.4 in Pin Spacing; Model: R0603; Category: Резистор; Distributer: АО "НПО ЭРКОН"
R21 R22 R24 R25 = Резисторы без указания рассеиваемой мощности: АЛЯР. 434110.005 ТУ; TU/GOST: АБШК.434110.023 ТУ; Product Code: 61 9900; Component Name: Р1-12-0,1-22 Ом±5%-М-"К"; Value: 22 Ом; Published: 8-Jun-2000; LatestRevisionDate: 17-Jul-2002; LatestRevisionNote: Re-released for DXP Platform.; PackageReference: AXIAL-0.4; Publisher: SPA CADETECH JSC; PackageDescription: Axial Device, Thru-Hole; 2 Leads; 0.4 in Pin Spacing; Model: R0603; Category: Резистор; Distributer: АО "НПО ЭРКОН"
R23 R26 = Резисторы без указания рассеиваемой мощности: АЛЯР. 434110.005 ТУ; TU/GOST: АБШК.434110.023 ТУ; Product Code: 61 9900; Component Name: Р1-12-0,1-1.5 кОм±5%-М-"К"; Value: 1.5 кОм; Published: 8-Jun-2000; LatestRevisionDate: 17-Jul-2002; LatestRevisionNote: Re-released for DXP Platform.; PackageReference: AXIAL-0.4; Publisher: SPA CADETECH JSC; PackageDescription: Axial Device, Thru-Hole; 2 Leads; 0.4 in Pin Spacing; Model: R0603; Category: Резистор; Distributer: АО "НПО ЭРКОН"
VD1 = Диоды Шоттки: фирма ST Microelectronics; Rule: PcbType=ProtelPcb; Value: 40 V; Model: BAT60JFILM SOD323F; Product Code: 63 1000; Component Name: BAT60JFILM; Distributer: АО "Чип и Дип"; Category: Диод Шоттки; TU/GOST: фирма ST Microelectronics
VT1 = Биполярный NPN: фирма Nexperia; TU/GOST: АДКБ.432140.555; Value: NPN; Model: КТ3102БМ; Product Code: 63 1000; Characteristic: 45В, 0.1А, 0.25Вт, 100МГц, h21e=450; Component Name: КТ229Г9; Published: 20.04.2021; Publisher: АО "НПО КАДЕТЕК"; Type: Транзистор; Distributer: АО «ГРУППА КРЕМНИЙ ЭЛ»; Category: Транзистор
XP4 = Вилка 3 контакта перемычка_1_2: KLS electronic co ltd; TU/GOST: РЮМК.430420.051 ТУ; Product Code: 34 6430; Component Name: СНП393-3ВП21-1-01-6,5; Distributer: АО "КАРАЧЕВСКИЙ ЗАВОД "ЭЛЕКТРОДЕТАЛЬ"; Category: Вилка
XP5 XP6 XP9 = Вилка 2 контакт: as XP3 on sheet ДФТВ.434519.003 л.1 Э3; Distributer: АО "КАРАЧЕВСКИЙ ЗАВОД "ЭЛЕКТРОДЕТАЛЬ"; Category: Вилка
XP7 = Вилка 6 контактов: РЮМК.430420.047 ТУ; TU/GOST: РЮМК.430420.051 ТУ; Product Code: 34 6430; Component Name: СНП393-6ВП21-1-01-6,5; Distributer: АО "КАРАЧЕВСКИЙ ЗАВОД "ЭЛЕКТРОДЕТАЛЬ"; Category: Вилка
XP8 = Вилка 4 контакта: Connfly electronic (Zhenqin); TU/GOST: РЮМК.430420.051 ТУ; Product Code: 34 6430; Component Name: СНП393-4ВП21-1-01-6,5; Distributer: АО "КАРАЧЕВСКИЙ ЗАВОД "ЭЛЕКТРОДЕТАЛЬ"; Category: Вилка
XP10 XP11 = Вилка 2 контакт: Connfly electronic (Zhenqin); TU/GOST: РЮМК.430420.041 ТУ; Product Code: 34 6430; Component Name: СНП377-2ВП21-1-14-6,0; Distributer: АО "КАРАЧЕВСКИЙ ЗАВОД "ЭЛЕКТРОДЕТАЛЬ"; Category: Вилка
XS5 = Розетка USB mini: Фирма "Te Connectivity"; Product Code: 66 7250; Model: mini USB type B; Component Name: 1734035-1; Type: Розетка; TU/GOST: Фирма "Te Connectivity"; Distributer: АО "Чип и Дип"; Category: Розетка
ZQ3 = Кварцевые резонаторы: КЖДГ.433513.017 ТУ; Alternating Manufacture: Chequers Electronic Limited; Product Code: 63 2100; Model: HC49S; TU/GOST: ТУ 6321-002-72715118-2006; Value: 12 MHz; Component Name: РК415-5ДС-8М -3 (24 пФ); Published: 24.05.2021; Publisher: АО "НПО КАДЕТЕК"; Distributer: АО "ПЬЕЗО"; Category: Кварцевые резонаторы; Type: SMD07050C4

## Nets that join several sheets
+3,3В: ДФТВ.434519.003 л.1 Э3 (25 pins), ДФТВ.434519.003 л.2 Э3 (XP4.2)
+3,3В_Ex: ДФТВ.434519.003 л.1 Э3 (C13.2 DA1.2), ДФТВ.434519.003 л.2 Э3 (XP4.3)
+5В: ДФТВ.434519.003 л.1 Э3 (XP1.17 XP1.18 XS1.5), ДФТВ.434519.003 л.2 Э3 (5 pins)
GND: ДФТВ.434519.003 л.1 Э3 (43 pins), ДФТВ.434519.003 л.2 Э3 (32 pins)
D3: ДФТВ.434519.003 л.1 Э3 (5 pins), ДФТВ.434519.003 л.2 Э3 (DD2.13 XP6.2)
D5: ДФТВ.434519.003 л.1 Э3 (7 pins), ДФТВ.434519.003 л.2 Э3 (DD2.12 XP6.1)
SWCT: ДФТВ.434519.003 л.1 Э3 (DD1.32), ДФТВ.434519.003 л.2 Э3 (XP8.2)
SWDT: ДФТВ.434519.003 л.1 Э3 (DD1.31), ДФТВ.434519.003 л.2 Э3 (XP8.4)